# Altium schematic sheet ludi_cartridge_v1.SchDoc
size A4
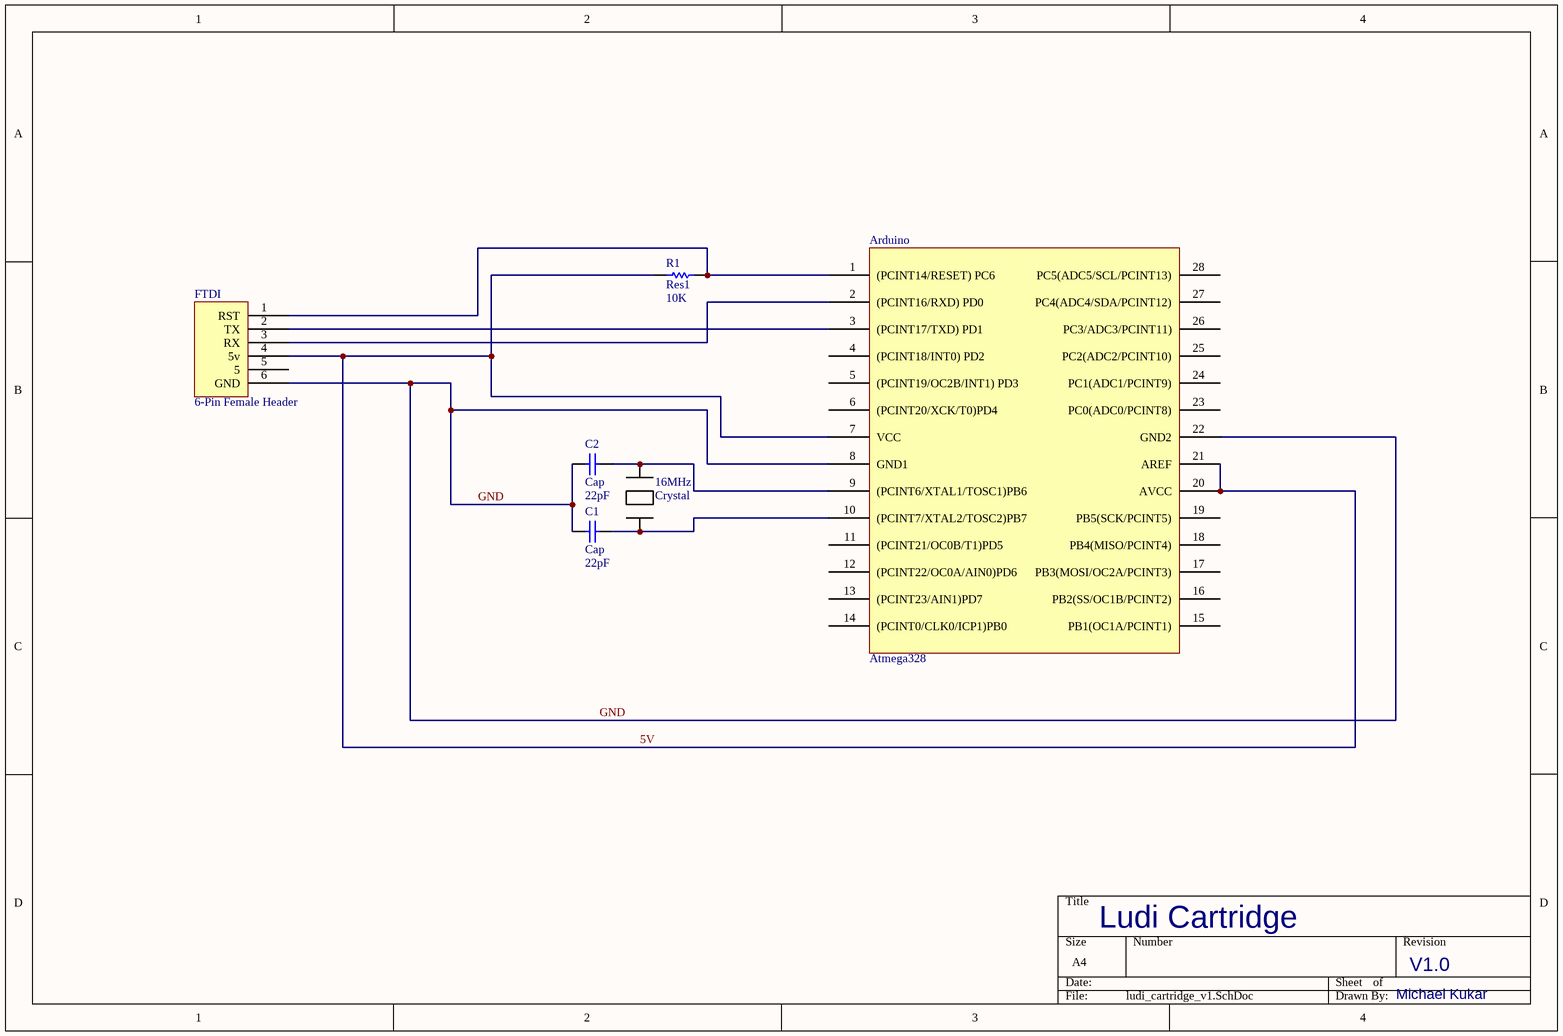
[diagram p0: ludi_cartridge_v1.SchDoc]

## Parts
16MHz  Crystal  [Crystal - duplicate]
Arduino  Atmega328  [AtmegaTQFP]
C1  Cap  value 22pF  [.1" spacing]
C2  Cap  value 22pF  [.1" spacing]
FTDI  6-Pin Female Header  [HDR1X6]
R1  Res1  value 10K  [AXIAL-0.3]

## Nets
5V: Arduino.7(VCC) Arduino.20(AVCC) Arduino.21(AREF) FTDI.4(5v) R1.1
GND: Arduino.8(GND1) Arduino.22(GND2) C1.1 C2.1 FTDI.6(GND)
Net16MHz_A: 16MHz.A Arduino.9((PCINT6/XTAL1/TOSC1)PB6) C2.2
Net16MHz_K: 16MHz.K Arduino.10((PCINT7/XTAL2/TOSC2)PB7) C1.2
NetArduino_1: Arduino.1((PCINT14/RESET)_PC6) FTDI.1(RST) R1.2
NetArduino_2: Arduino.2((PCINT16/RXD)_PD0) FTDI.3(RX)
NetArduino_3: Arduino.3((PCINT17/TXD)_PD1) FTDI.2(TX)

Not connected (* = marked no-connect by the designer): Arduino 4((PCINT18/INT0)_PD2) 5((PCINT19/OC2B/INT1)_PD3) 6((PCINT20/XCK/T0)PD4) 11((PCINT21/OC0B/T1)PD5) 12((PCINT22/OC0A/AIN0)PD6) 13((PCINT23/AIN1)PD7) 14((PCINT0/CLK0/ICP1)PB0) 15(PB1(OC1A/PCINT1)) 16(PB2(SS/OC1B/PCINT2)) 17(PB3(MOSI/OC2A/PCINT3)) 18(PB4(MISO/PCINT4)) 19(PB5(SCK/PCINT5)) 23(PC0(ADC0/PCINT8)) 24(PC1(ADC1/PCINT9)) 25(PC2(ADC2/PCINT10)) 26(PC3/ADC3/PCINT11)) 27(PC4(ADC4/SDA/PCINT12)) 28(PC5(ADC5/SCL/PCINT13)); FTDI 5

## Notes on the sheet
- Ludi Cartridge
- V1.0
- Michael Kukar

## Library data of the parts
C1 C2 = Cap: Capacitor; Published: 8-Jun-2000; LatestRevisionDate: 17-Jul-2002; LatestRevisionNote: Re-released for DXP Platform.; PackageReference: RAD-0.3; Publisher: Altium Limited; PackageDescription: Radial Cap, Thru-Hole; 2 Leads; 0.3 in Pin Spacing
R1 = Res1: Resistor; Published: 8-Jun-2000; LatestRevisionDate: 17-Jul-2002; LatestRevisionNote: Re-released for DXP Platform.; PackageReference: AXIAL-0.3; Publisher: Altium Limited; PackageDescription: Axial Device, Thru-Hole; 2 Leads; 0.3 in Pin Spacing